# Altium schematic sheet Overview.SchDoc
size A4; SheetNumber: 1; SheetTotal: 10
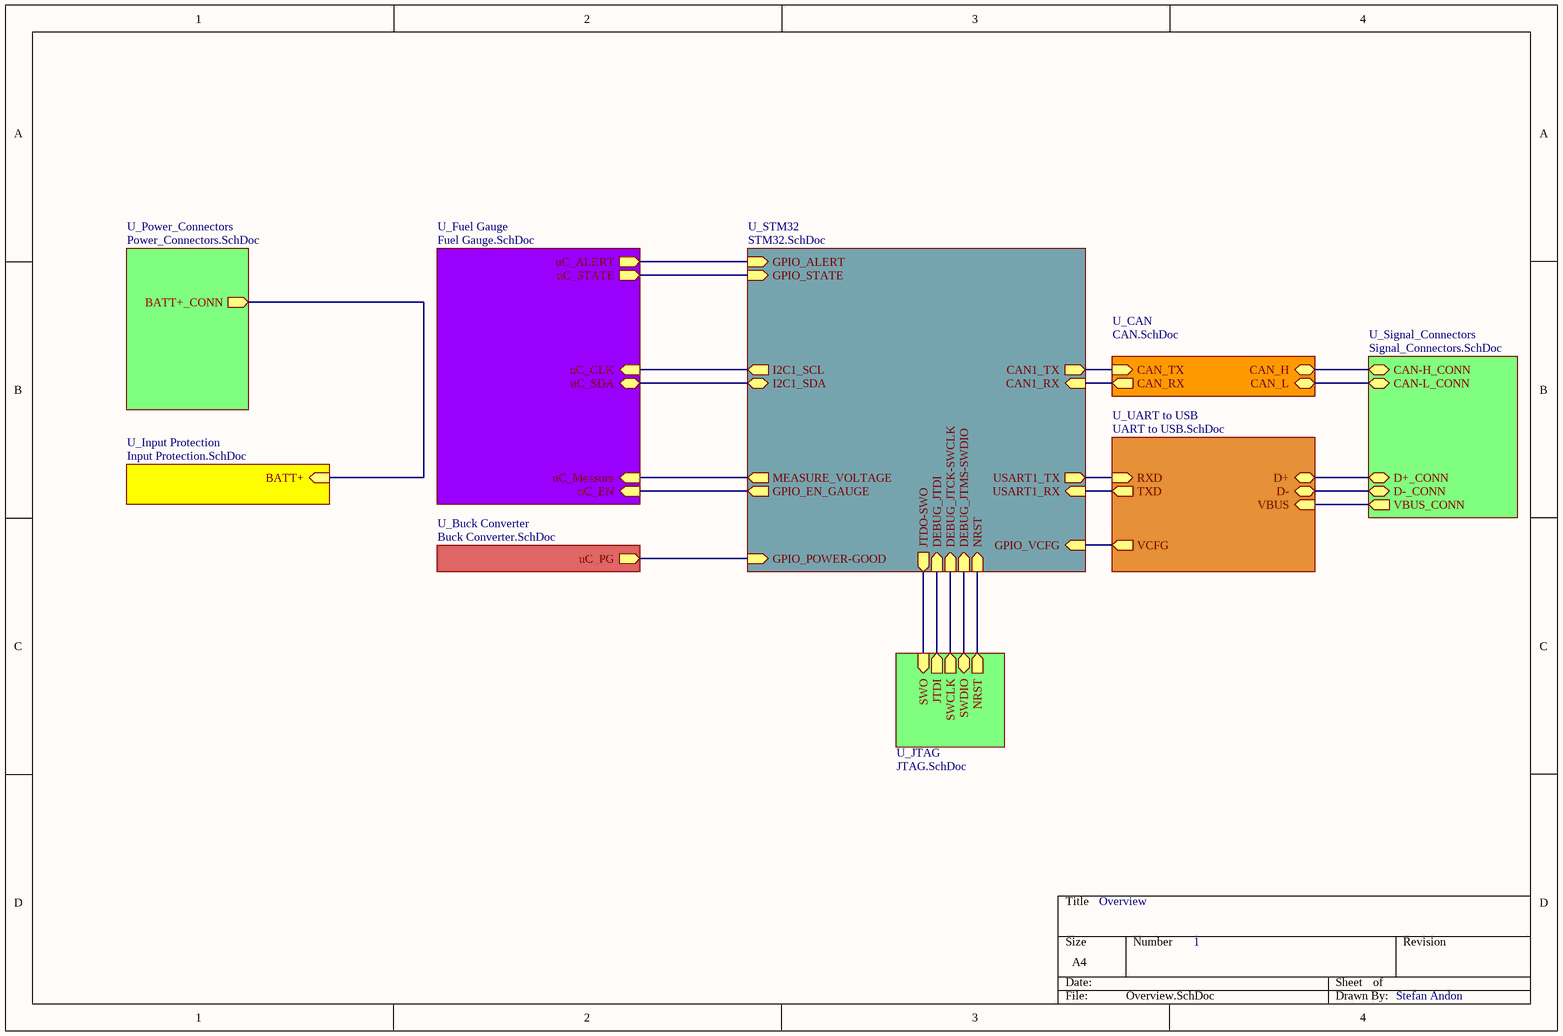
[diagram p0: Overview.SchDoc]

## Sub-sheets
U_Buck Converter = Buck Converter.SchDoc: uC_PG (out)
U_CAN = CAN.SchDoc: CAN_TX (in), CAN_RX (out), CAN_H (bidir), CAN_L (bidir)
U_Fuel Gauge = Fuel Gauge.SchDoc: uC_ALERT (out), uC_STATE (out), uC_EN (in), uC_Measure (in), uC_SDA (bidir), uC_CLK (in)
U_Input Protection = Input Protection.SchDoc: BATT+ (in)
U_JTAG = JTAG.SchDoc: SWDIO (bidir), SWCLK (out), SWO (in), JTDI (out), NRST (out)
U_Power_Connectors = Power_Connectors.SchDoc: BATT+_CONN (out)
U_Signal_Connectors = Signal_Connectors.SchDoc: CAN-H_CONN (bidir), CAN-L_CONN (bidir), VBUS_CONN (out), D+_CONN (bidir), D-_CONN (bidir)
U_STM32 = STM32.SchDoc: I2C1_SDA (bidir), I2C1_SCL (out), CAN1_RX (in), CAN1_TX (out), JTDO-SWO (out), DEBUG_JTDI (in), DEBUG_JTCK-SWCLK (in), DEBUG_JTMS-SWDIO (in), NRST (in), USART1_RX (in), USART1_TX (out), GPIO_ALERT (in), GPIO_STATE (in), GPIO_EN_GAUGE (out), MEASURE_VOLTAGE (out), GPIO_POWER-GOOD (in), GPIO_VCFG (in)
U_UART to USB = UART to USB.SchDoc: D+ (bidir), D- (bidir), VCFG (out), TXD (out), RXD (in), VBUS (in)

## Nets
(unnamed): sheet U_Fuel Gauge/uC_ALERT, sheet U_STM32/GPIO_ALERT
(unnamed): sheet U_Fuel Gauge/uC_STATE, sheet U_STM32/GPIO_STATE
(unnamed): sheet U_Fuel Gauge/uC_EN, sheet U_STM32/GPIO_EN_GAUGE
(unnamed): sheet U_Fuel Gauge/uC_Measure, sheet U_STM32/MEASURE_VOLTAGE
(unnamed): sheet U_Fuel Gauge/uC_SDA, sheet U_STM32/I2C1_SDA
(unnamed): sheet U_Fuel Gauge/uC_CLK, sheet U_STM32/I2C1_SCL
(unnamed): sheet U_Buck Converter/uC_PG, sheet U_STM32/GPIO_POWER-GOOD
(unnamed): sheet U_Input Protection/BATT+, sheet U_Power_Connectors/BATT+_CONN
(unnamed): sheet U_STM32/CAN1_RX, sheet U_CAN/CAN_RX
(unnamed): sheet U_STM32/CAN1_TX, sheet U_CAN/CAN_TX
(unnamed): sheet U_STM32/JTDO-SWO, sheet U_JTAG/SWO
(unnamed): sheet U_STM32/DEBUG_JTDI, sheet U_JTAG/JTDI
(unnamed): sheet U_STM32/DEBUG_JTCK-SWCLK, sheet U_JTAG/SWCLK
(unnamed): sheet U_STM32/DEBUG_JTMS-SWDIO, sheet U_JTAG/SWDIO
(unnamed): sheet U_STM32/NRST, sheet U_JTAG/NRST
(unnamed): sheet U_STM32/USART1_RX, sheet U_UART to USB/TXD
(unnamed): sheet U_STM32/USART1_TX, sheet U_UART to USB/RXD
(unnamed): sheet U_STM32/GPIO_VCFG, sheet U_UART to USB/VCFG
(unnamed): sheet U_CAN/CAN_H, sheet U_Signal_Connectors/CAN-H_CONN
(unnamed): sheet U_CAN/CAN_L, sheet U_Signal_Connectors/CAN-L_CONN
(unnamed): sheet U_UART to USB/D+, sheet U_Signal_Connectors/D+_CONN
(unnamed): sheet U_UART to USB/D-, sheet U_Signal_Connectors/D-_CONN
(unnamed): sheet U_UART to USB/VBUS, sheet U_Signal_Connectors/VBUS_CONN

## Notes on the sheet
- Overview
- 1
- Stefan Andon